# Altium schematic sheet zulu_a7_2.SchDoc
size 270 x 341 mm; Author: Christian Tambe; VERSION#: 1.0; Origin: Eagle; OriginPath: C:\Users\tambe\Documents\Electronics\Zulu_A7\Zulu_Altrium\zulu_a7.sch; OriginSheet: 3; OriginDescription: General IO
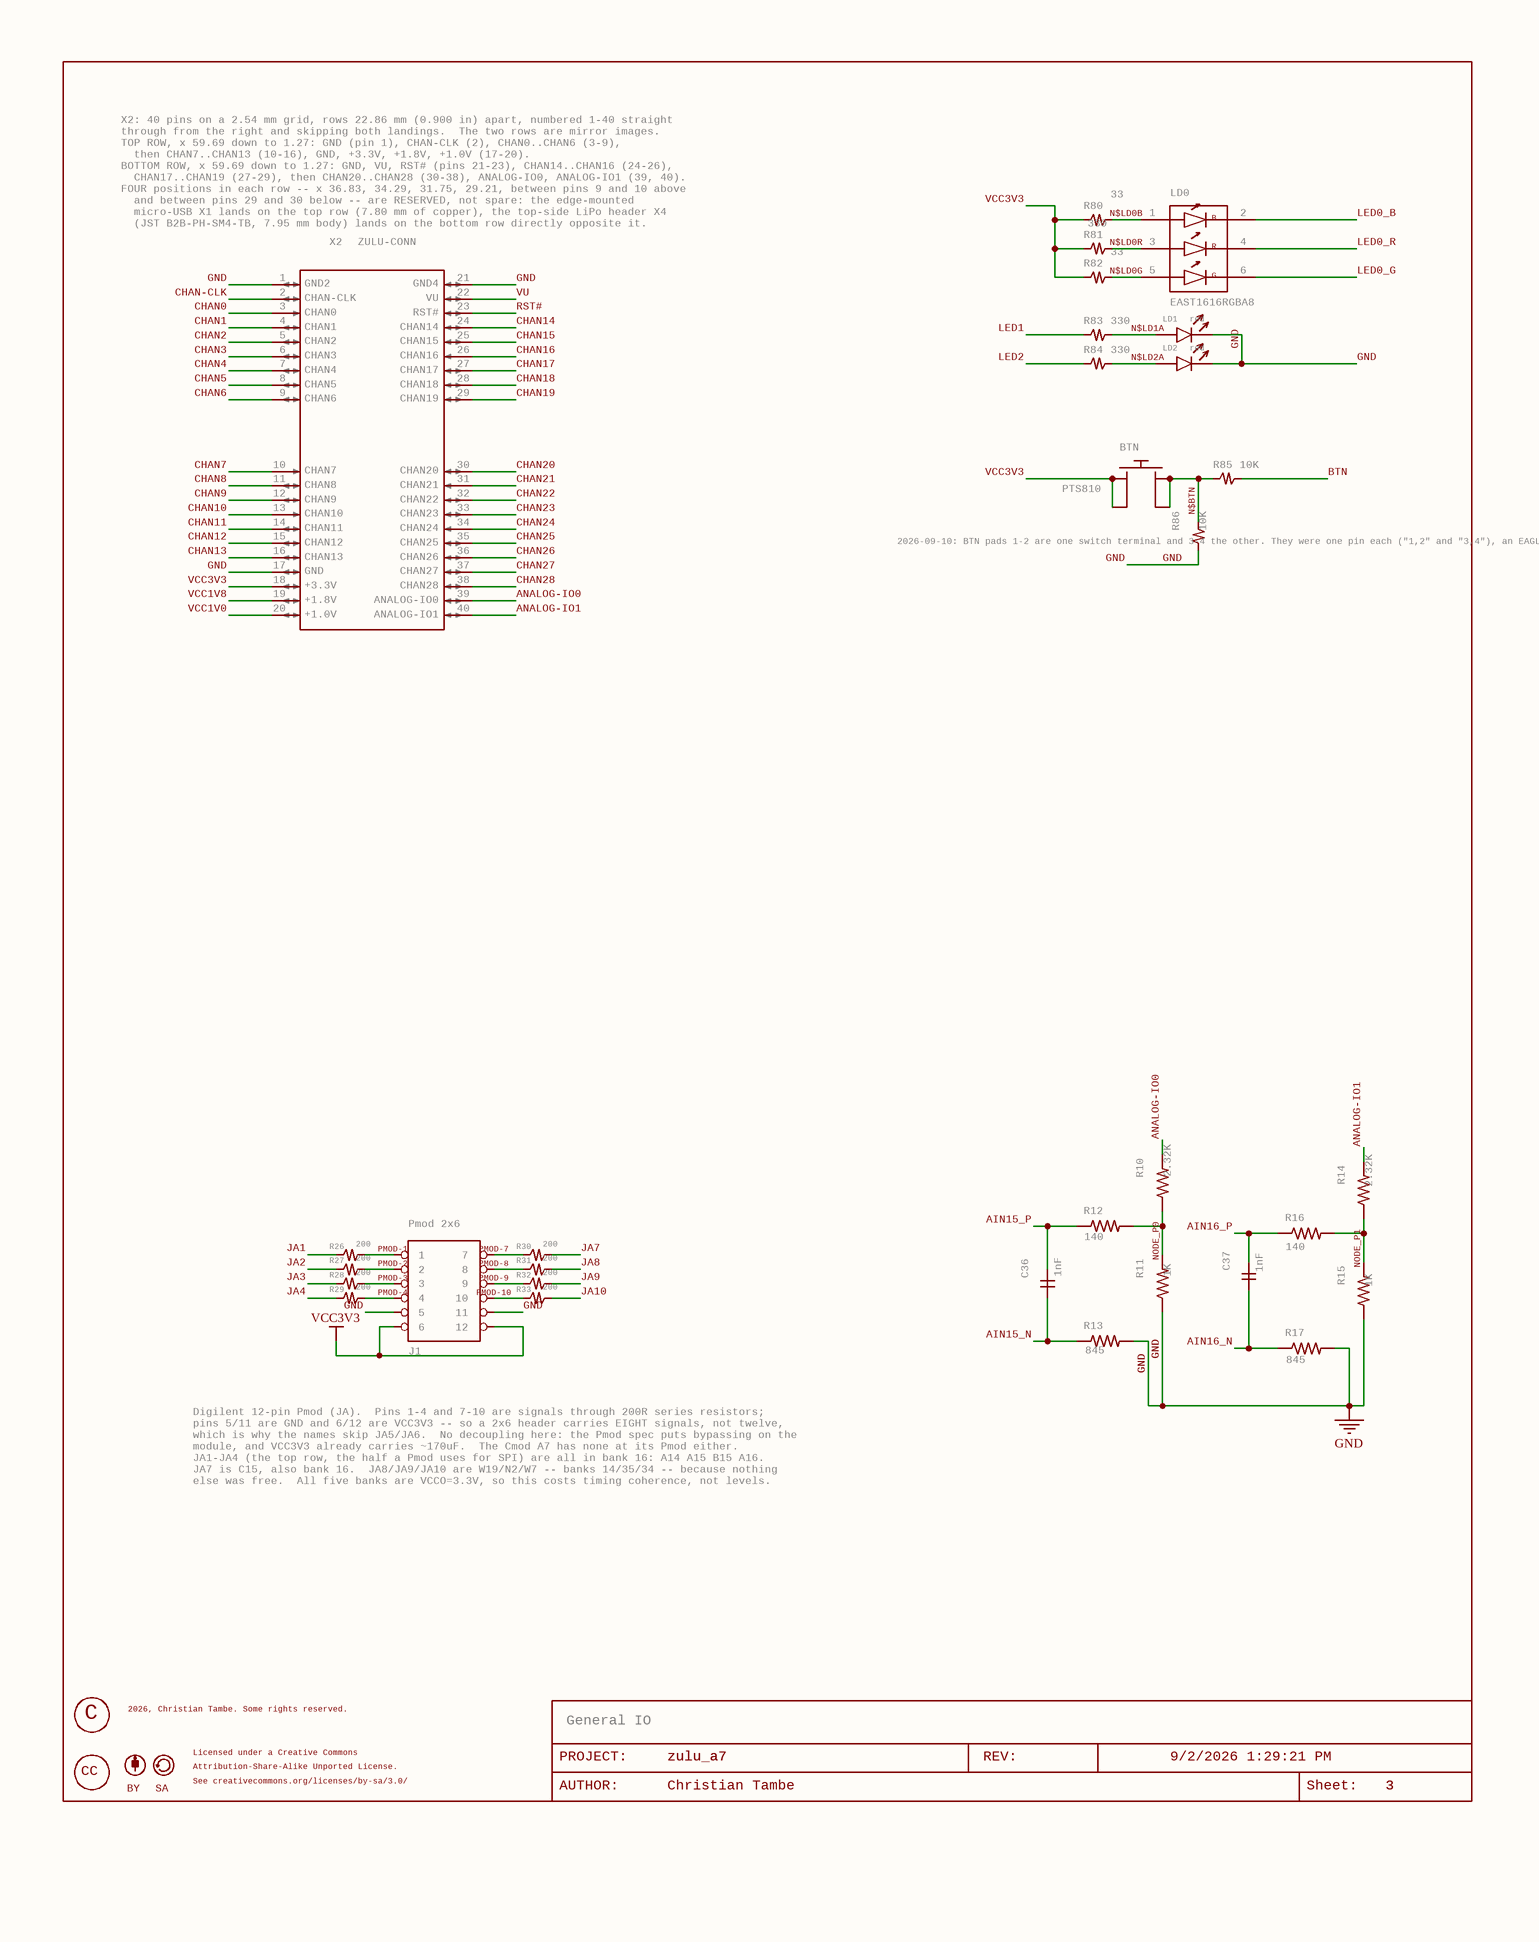
[diagram p0: zulu_a7_2.SchDoc]

## Parts
BTN  PTS810  [PTS810]
C36  1nF  [C0402]
C37  1nF  [C0402]
FRAME3  LAST_DATE_TIME: 9/2/2026 1:29:21 PM  Sheet: Sheet:  SHEET: 3  REV: REV:  PROJECT: PROJECT:  DRAWING_NAME: zulu_a7  AUTHOR: Christian Tambe  (hidden comment: DOCFIELD)  (graphical)
J1  Pmod 2x6  [2X06]
LD0  EAST1616RGBA8  [EVERLIGHT-19-337]
LD1  red  [LED0603]
LD2  red  [LED0603]
R10  2.32K  [R0201]
R11  1K  [R0201]
R12  140  [R0201]
R13  845  [R0201]
R14  2.32K  [R0201]
R15  1K  [R0201]
R16  140  [R0201]
R17  845  [R0201]
R26  200  [R0201]
R27  200  [R0201]
R28  200  [R0201]
R29  200  [R0201]
R30  200  [R0201]
R31  200  [R0201]
R32  200  [R0201]
R33  200  [R0201]
R80  33  [R0402]
R81  330  [R0402]
R82  33  [R0402]
R83  330  [R0402]
R84  330  [R0402]
R85  10K  [R0402]
R86  10K  [R0402]
U$2  CC_CC  [CC_CC]  (value not drawn)
U$3  CC_BY  [CC_BY]  (value not drawn)
U$4  CC_SA  [CC_SA]  (value not drawn)
U$5  CC_COPYRIGHT  [CC_COPYRIGHT]  (value not drawn)
X2  GATE: CHAN-CLK  [ZULU-DIP37]  (hidden comment: ZULU-CONN)  (parts A,B,C,D,E,F,G,H,I,J,K,L,M,N,O,P,Q,R,S,T,U,V,W,X,Y,Z,27,28,29,30,31,32,33,34,35,36,37,38,39,40,41 of 41)

## Nets
GND: J1.5 J1.11 LD1.K LD2.K R11.1 R13.2 R15.1 R17.2 R86.1 X2.1 X2.17 X2.21
VCC3V3: BTN.1 BTN.2 J1.6 J1.12 R80.1 R81.1 R82.1 X2.18
AIN15_N: C36.1 R13.1
AIN15_P: C36.2 R12.1
AIN16_N: C37.1 R17.1
AIN16_P: C37.2 R16.1
ANALOG-IO0: R10.2 X2.39
ANALOG-IO1: R14.2 X2.40
BTN: R85.2
CHAN0: X2.3
CHAN1: X2.4
CHAN2: X2.5
CHAN3: X2.6
CHAN4: X2.7
CHAN5: X2.8
CHAN6: X2.9
CHAN7: X2.10
CHAN8: X2.11
CHAN9: X2.12
CHAN10: X2.13
CHAN11: X2.14
CHAN12: X2.15
CHAN13: X2.16
CHAN14: X2.24
CHAN15: X2.25
CHAN16: X2.26
CHAN17: X2.27
CHAN18: X2.28
CHAN19: X2.29
CHAN20: X2.30
CHAN21: X2.31
CHAN22: X2.32
CHAN23: X2.33
CHAN24: X2.34
CHAN25: X2.35
CHAN26: X2.36
CHAN27: X2.37
CHAN28: X2.38
CHAN-CLK: X2.2
JA1: R26.1
JA2: R27.1
JA3: R28.1
JA4: R29.1
JA7: R30.2
JA8: R31.2
JA9: R32.2
JA10: R33.2
LED0_B: LD0.2
LED0_G: LD0.6
LED0_R: LD0.4
LED1: R83.1
LED2: R84.1
N$BTN: BTN.3 BTN.4 R85.1 R86.2
N$LD0B: LD0.1 R80.2
N$LD0G: LD0.5 R82.2
N$LD0R: LD0.3 R81.2
N$LD1A: LD1.A R83.2
N$LD2A: LD2.A R84.2
NODE_P0: R10.1 R11.2 R12.2
NODE_P1: R14.1 R15.2 R16.2
PMOD-1: J1.1 R26.2
PMOD-2: J1.2 R27.2
PMOD-3: J1.3 R28.2
PMOD-4: J1.4 R29.2
PMOD-7: J1.7 R30.1
PMOD-8: J1.8 R31.1
PMOD-9: J1.9 R32.1
PMOD-10: J1.10 R33.1
RST#: X2.23
VCC1V0: X2.20
VCC1V8: X2.19
VU: X2.22

## Notes on the sheet
- (near X2) X2: 40 pins on a 2.54 mm grid, rows 22.86 mm (0.900 in) apart, numbered 1-40 straight
  through from the right and skipping both landings.  The two rows are mirror images.
  TOP ROW, x 59.69 down to 1.27: GND (pin 1), CHAN-CLK (2), CHAN0..CHAN6 (3-9),
  then CHAN7..CHAN13 (10-16), GND, +3.3V, +1.8V, +1.0V (17-20).
  BOTTOM ROW, x 59.69 down to 1.27: GND, VU, RST# (pins 21-23), CHAN14..CHAN16 (24-26),
  CHAN17..CHAN19 (27-29), then CHAN20..CHAN28 (30-38), ANALOG-IO0, ANALOG-IO1 (39, 40).
  FOUR positions in each row -- x 36.83, 34.29, 31.75, 29.21, between pins 9 and 10 above
  and between pins 29 and 30 below -- are RESERVED, not spare: the edge-mounted
  micro-USB X1 lands on the top row (7.80 mm of copper), the top-side LiPo header X4
  (JST B2B-PH-SM4-TB, 7.95 mm body) lands on the bottom row directly opposite it.
  Each landing is 12.70 mm between the neighbouring pin centres, 11.176 mm clear.
  THREE grounds: pins 1, 17, 21.  Pin 18 is the only +3.3V pin.  Pin 22 VU SOURCES the
  4.4 V rail (bq24232 OUT) -- the +5V-INPUT pin and its D2/D3 went on 2026-09-09,
  so external power is the LiPo on X4.  THE PCB FOOTPRINT MUST BE REDRAWN: 40 pads named 1-40.
- (near R86) 2026-09-10: BTN pads 1-2 are one switch terminal and 3-4 the other. They were one pin each ("1,2" and "3,4"), an EAGLE multi-pad import artefact that matches no Altium footprint pad; now four pins, each pad on its partner's net.
- Digilent 12-pin Pmod (JA).  Pins 1-4 and 7-10 are signals through 200R series resistors;
  pins 5/11 are GND and 6/12 are VCC3V3 -- so a 2x6 header carries EIGHT signals, not twelve,
  which is why the names skip JA5/JA6.  No decoupling here: the Pmod spec puts bypassing on the
  module, and VCC3V3 already carries ~170uF.  The Cmod A7 has none at its Pmod either.
  JA1-JA4 (the top row, the half a Pmod uses for SPI) are all in bank 16: A14 A15 B15 A16.
  JA7 is C15, also bank 16.  JA8/JA9/JA10 are W19/N2/W7 -- banks 14/35/34 -- because nothing
  else was free.  All five banks are VCCO=3.3V, so this costs timing coherence, not levels.
- 2026, Christian Tambe. Some rights reserved.
- (near FRAME3) General IO
- (near U$4) Licensed under a Creative Commons
- (near U$4) Attribution-Share-Alike Unported License.
- (near U$4) See creativecommons.org/licenses/by-sa/3.0/
- (near FRAME3) AUTHOR:

## Library data of the parts
BTN = SWITCH_TACT: Tactile switch, momentary, normally open. Package PTA-142 is assigned and drawn from the datasheet land; the note that said otherwise was left behind when it was.; GateName_1: G$1; MANF#: PTS810SJM250SMTR LFS; MANF: Littelfuse (C&K); NOTE: PTS810SJM250SMTR LFS, Littelfuse (C&K) PTS810 series, Datasheet/Littelfuse-CK-Tactile-PTS810-Series-Datasheet.pdf rev 02/02/26. Recommended PCB layout (p1): four pads (5.2 - 3.1)/2 = 1.05 mm wide by (2.8 - 1.5)/2 = 0.65 mm high, centred at +-2.075 mm and +-1.075 mm; body 4.2 x 3.2 mm, J-leads to 4.6 mm, height 2.5 mm. The datasheet schematic joins 1 with 2 and 3 with 4, so pins 1,2 (VCC3V3) and 3,4 (BTN) are unchanged. Footprint PTS810 to be drawn at the PCB stage; the PTA-142 pattern (1.6 mm pads at +-3.75 / +-1.4 mm) does not fit. Other force grades on the same pads: K 2.6 N, G 4.0 N, S 6.0 N. Digi-Key 106,352 in stock at $0.58, 16-week lead (2026-09-08); LCSC C116501 dry, the K grade C221896 stocked.; SPEC: tactile switch SPST-NO momentary, SMT J-lead, 4.2 x 3.2 x 2.5 mm, 1.6 N (160 gf), 0.15 mm travel, 150000 cycles, 16 VDC 50 mA, -40..85 C; terminals 1-2 and 3-4 internally common (PTS810 sheet p1); replaced the unsourceable PTA-142 on 2026-09-08; SymbolName_1: SWITCH_TACT; LibraryName: ctambe; DeviceSetName: SWITCH_TACT
C36 C37 = C-GENERICC0402: CAPACITOR, generic non-polarized, horizontal pins; GateName_1: G$1; SymbolName_1: C-GENERIC-H; MANF: Murata; MANF#: GRM155R71H102KA01D; SPEC: X7R 50V +-10%, 0.50 mm max; DeviceName: C0402; LibraryName: rcl; DeviceSetName: C-GENERIC
FRAME3 = DOCFIELD: DOCUMENT FIELD; GateName_1: G$1; SymbolName_1: DOCFIELD; LibraryName: ctambe; DeviceSetName: DOCFIELD
J1 = PINHD-2X6: PIN HEADER 2x6 (Pmod)   Digilent peripheral-module connector. Pins 1-4 and 7-10 are signals, 5 and 11 are GND, 6 and 12 are VCC -- eight signals, not twelve.; GateName_1: G$1; SymbolName_1: PINH2X6; MANF: Sullins; MANF#: PPTC062LFBN-RC; NOTE: A SOCKET, NOT PINS, AND THE LIBRARY NAME DISAGREES WITH THAT. The package is called PIN HEADER 2x6 and the deviceset PINHD-2X6, which is inherited naming, but on a Digilent Pmod the HOST carries the female socket and the peripheral module carries the male pins that plug into it. Cmod A7 is the same. Order male pins off that library name and no Pmod will mate. The footprint is 12 plated holes on 2.54 either way, so a male header such as Sullins PRPC006DAAN-RC drops into the same land if you would rather have pins and a cable. Height 8.5 mm is not a problem: J1 is on the FRONT, and it is the back that faces a breadboard a couple of millimetres away.; SPEC: 2x6 female header, 2.54 mm pitch, through-hole, 12 way -- Pmod host socket; LibraryName: ctambe; DeviceSetName: PINHD-2X6
LD0 = LED_RGB: RGB LED, three independent diodes, 6 pads: anodes 1/3/5 (B/R/G), cathodes 2/4/6 (B/R/G). Everlight 19-337 package.; GateName_1: G$1; NOTE: Everlight EAST1616RGBA8 = 19-337/R6GHBHW-A01/2T (DSE-0009126 Rev.3, 22-Dec-2016); water-clear twin EAST1616RGBA4 = 19-337/R6GHBHC-A01/2T. Same body, lens and recommended pads as the Victory VS NRD8 it replaces (0.55 x 0.4 outer pads at +-0.725 mm, 0.7 x 0.5 middle, 1.9 / 2.2 mm spans) and the same arrangement: cathodes in the left column under the cathode mark, blue / red / green top to bottom, anodes on the right. Only the numbering differs (Everlight anodes 1/3/5 on the right, cathodes 2/4/6 on the left), so on 2026-09-08 the pins were renumbered 1/2/3 -> 2/4/6 and 4/5/6 -> 1/3/5 with the nets unchanged: LED0_B/R/G on the cathodes to the FPGA, N$LD0B/R/G on the anodes through R80/R81/R82. Footprint EVERLIGHT-19-337 = the VS-NRD8 pattern with Everlight pad numbers. Digi-Key 15,840 in stock at $0.43 on 2026-09-08.; SPEC: RGB LED, three independent diodes, 1.6 x 1.6 x 0.35 mm, diffused lens, 624 / 525 / 468 nm, VF typ 2.05 / 3.2 / 3.2 V (max 2.4 / 3.7 / 3.7), IF 25 mA max per colour; anodes 1 B, 3 R, 5 G, cathodes 2 B, 4 R, 6 G (19-337 sheet p8); replaced the distributor-less Victory VS NRD8 on 2026-09-08; SymbolName_1: LED_RGB; LibraryName: ctambe; DeviceSetName: LED_RGB; B: B; R: R; G: G; MANF: Everlight; MANF#: EAST1616RGBA8
LD1 = LED: GateName_1: G$1; MANF: Lite-On; MANF#: LTST-C191KRKT; NOTE: User status LED, driven straight off an FPGA pin through R83 at 330R: (3.3 - Vf)/330 is 3.9 mA green, 4.2 red, 3.6 yellow, and 1.2 mA blue or white. Any of the first three is comfortable and well inside an LVCMOS33 pin's 12 mA. RED IS A PREFERENCE, NOT A CONSTRAINT -- the circuit takes green just as happily. It is red so that the two user LEDs read differently from LD5, which is green and means power good; on a board being brought up that is worth being able to tell apart at a glance. Same LTST-C191 family and the same 0603 land as LD5, so it is one line in the catalogue, not two. Confirm the suffix before ordering.; SPEC: red indicator, 0603, Vf 2.1V max at 4mA; SymbolName_1: LED; LibraryName: ctambe; DeviceSetName: LED
LD2 = LED: GateName_1: G$1; MANF: Lite-On; MANF#: LTST-C191KRKT; NOTE: User status LED, driven straight off an FPGA pin through R84 at 330R: (3.3 - Vf)/330 is 3.9 mA green, 4.2 red, 3.6 yellow, and 1.2 mA blue or white. Any of the first three is comfortable and well inside an LVCMOS33 pin's 12 mA. RED IS A PREFERENCE, NOT A CONSTRAINT -- the circuit takes green just as happily. It is red so that the two user LEDs read differently from LD5, which is green and means power good; on a board being brought up that is worth being able to tell apart at a glance. Same LTST-C191 family and the same 0603 land as LD5, so it is one line in the catalogue, not two. Confirm the suffix before ordering.; SPEC: red indicator, 0603, Vf 2.1V max at 4mA; SymbolName_1: LED; LibraryName: ctambe; DeviceSetName: LED
R10 R14 = R-US_R0201: RESISTOR, American symbol; GateName_1: G$1; SymbolName_1: R-US; DeviceSetName: R-US_; MANF: Yageo; MANF#: RC0201FR-072K32L; SPEC: thick film +-1%, 1/20W, 0201; DeviceName: R0201; LibraryName: rcl
R11 R15 = R-US_R0201: RESISTOR, American symbol; GateName_1: G$1; SymbolName_1: R-US; DeviceSetName: R-US_; MANF: Yageo; MANF#: RC0201FR-071KL; SPEC: thick film +-1%, 1/20W, 0201; DeviceName: R0201; LibraryName: rcl
R12 R16 = R-US_R0201: RESISTOR, American symbol; GateName_1: G$1; SymbolName_1: R-US; DeviceSetName: R-US_; MANF: Yageo; MANF#: RC0201FR-07140RL; SPEC: thick film +-1%, 1/20W, 0201; DeviceName: R0201; LibraryName: rcl
R13 R17 = R-US_R0201: RESISTOR, American symbol; GateName_1: G$1; SymbolName_1: R-US; DeviceSetName: R-US_; MANF: Yageo; MANF#: RC0201FR-07845RL; SPEC: thick film +-1%, 1/20W, 0201; DeviceName: R0201; LibraryName: rcl
R26-R33 = R-US_SMALLR0201: RESISTOR, American symbol, small 2-zigzag variant (sheet 2 only); GateName_1: G$1; MANF: Yageo; MANF#: RC0201FR-07200RL; SPEC: thick film +-1%, 1/20W, 0201; SymbolName_1: R-US_SMALL; DeviceName: R0201; LibraryName: rcl; DeviceSetName: R-US_SMALL
R80 R82 = R-US_SMALLR0402: RESISTOR, American symbol, small 2-zigzag variant (sheet 2 only); GateName_1: G$1; MANF: Yageo; MANF#: RC0402FR-0733RL; NOTE: RGB LED balance. The green and blue dice are 3.3 V-class parts on a 3.3 V rail, so the resistor never dominates their current -- that is structural and no resistor value fixes it. What the values CAN do is stop red swamping the other two. As built, and as Cmod A7 ships the same LED, 182/182/100 gave red 6.9 mA against green 1.9 and blue 1.5: red about four times either. At 330/33/33 it is red 3.8, green 2.9, blue 2.9. Worst case improves too, not just nominal -- green with a part 0.15 V high in Vf goes from 1.4 mA to 1.8. Lower resistors do make the current MORE sensitive in percentage terms, 77 percent of nominal retained at 100R against 61 at 33R, but the absolute floor is what you see and it rises. Currents read off the datasheet's own Vf/If curve at the working point, not off the 20 mA table.; SPEC: thick film +-1%, 1/16W, 0402; SymbolName_1: R-US_SMALL; DeviceName: R0402; LibraryName: rcl; DeviceSetName: R-US_SMALL
R81 = R-US_SMALLR0402: RESISTOR, American symbol, small 2-zigzag variant (sheet 2 only); GateName_1: G$1; MANF: Yageo; MANF#: RC0402FR-07330RL; NOTE: RGB LED balance. The green and blue dice are 3.3 V-class parts on a 3.3 V rail, so the resistor never dominates their current -- that is structural and no resistor value fixes it. What the values CAN do is stop red swamping the other two. As built, and as Cmod A7 ships the same LED, 182/182/100 gave red 6.9 mA against green 1.9 and blue 1.5: red about four times either. At 330/33/33 it is red 3.8, green 2.9, blue 2.9. Worst case improves too, not just nominal -- green with a part 0.15 V high in Vf goes from 1.4 mA to 1.8. Lower resistors do make the current MORE sensitive in percentage terms, 77 percent of nominal retained at 100R against 61 at 33R, but the absolute floor is what you see and it rises. Currents read off the datasheet's own Vf/If curve at the working point, not off the 20 mA table.; SPEC: thick film +-1%, 1/16W, 0402; SymbolName_1: R-US_SMALL; DeviceName: R0402; LibraryName: rcl; DeviceSetName: R-US_SMALL
R83 R84 = R-US_SMALLR0402: RESISTOR, American symbol, small 2-zigzag variant (sheet 2 only); GateName_1: G$1; MANF: Yageo; MANF#: RC0402FR-07330RL; SPEC: thick film +-1%, 1/16W, 0402; SymbolName_1: R-US_SMALL; DeviceName: R0402; LibraryName: rcl; DeviceSetName: R-US_SMALL
R85 R86 = R-US_SMALLR0402: RESISTOR, American symbol, small 2-zigzag variant (sheet 2 only); GateName_1: G$1; MANF: Yageo; MANF#: RC0402FR-0710KL; SPEC: thick film +-1%, 1/16W, 0402; SymbolName_1: R-US_SMALL; DeviceName: R0402; LibraryName: rcl; DeviceSetName: R-US_SMALL
U$2 = CC_CC: GateName_1: G$1; SymbolName_1: CC_CC; LibraryName: ctambe; DeviceSetName: CC_CC; CC: CC
U$3 = CC_BY: GateName_1: G$1; SymbolName_1: CC_BY; LibraryName: ctambe; DeviceSetName: CC_BY; BY: BY
U$4 = CC_SA: GateName_1: G$1; SymbolName_1: CC_SA; LibraryName: ctambe; DeviceSetName: CC_SA; SA: SA
U$5 = CC_COPYRIGHT: GateName_1: G$1; SymbolName_1: CC_COPYRIGHT; LibraryName: ctambe; DeviceSetName: CC_COPYRIGHT; C: C
X2 = ZULU-CONN: Zulu A7 Board Connector; SymbolName_1: PIN_GATE_IO; GateName_2: CHAN0; SymbolName_2: PIN_GATE_IN; GateName_3: CHAN1; GateName_4: CHAN2; GateName_5: CHAN3; GateName_6: CHAN4; GateName_7: CHAN5; GateName_8: CHAN6; GateName_9: CHAN7; GateName_10: CHAN8; GateName_11: CHAN9; GateName_12: CHAN10; GateName_13: CHAN11; GateName_14: +1.8V; GateName_15: +3.3V; GateName_16: GND; GateName_17: +1.0V; GateName_18: RST#; GateName_19: CHAN14; GateName_20: CHAN15; GateName_21: CHAN16; GateName_22: CHAN17; GateName_23: CHAN18; GateName_24: CHAN19; GateName_25: CHAN20; GateName_26: CHAN21; GateName_27: CHAN22; GateName_28: CHAN23; GateName_29: CHAN24; GateName_30: CHAN25; GateName_31: CHAN26; GateName_32: CHAN27; GateName_33: ANALOG-IO0; GateName_34: ANALOG-IO1; GateName_35: CHAN28; GateName_36: G$1; SymbolName_36: PV_GATE; GateName_37: GND2; GateName_38: CHAN12; GateName_39: CHAN13; GateName_40: GND4; GateName_41: VU; MANF: Sullins; MANF#: 2x PRPC009SAAN-RC + 2x PRPC011SAAN-RC; SPEC: four 0.1 in male breakaway header strips, 0.64 mm square gold-flash pins, 2.54 mm pitch, through-hole, mounted from the underside, two part numbers and two of each per board: PRPC009SAAN-RC 1x9 twice (pins 1-9 and 21-29) and PRPC011SAAN-RC 1x11 twice (pins 10-20 and 30-40); the two rows are cut identically since the LiPo landing was moved opposite the micro-USB on 2026-09-09; NOTE: Pin field ZULU-DIP37: 40 pins of 1.016 mm on 2.54 mm pitch, two rows 22.86 mm (0.900 in) apart, numbered 1-40 straight through and skipping both landings. The rows are mirror images: top row pins 1-9 (x 59.69..39.37) = GND, CHAN-CLK, CHAN0..CHAN6, FOUR positions for the micro-USB X1 (36.83..29.21), pins 10-20 (26.67..1.27) = CHAN7..CHAN13, GND, +3.3V, +1.8V, +1.0V (channel order since 2026-09-09, power pins re-ordered 2026-10-07); bottom row pins 21-29 (59.69..39.37), FOUR positions for the LiPo header X4 at the SAME four x values (36.83..29.21), pins 30-40 (26.67..1.27), so X4 sits on the top side directly opposite the edge-mounted USB receptacle. Each landing is 12.70 mm between the neighbouring pin centres, 11.176 mm clear: the JST B2B-PH-SM4-TB body is 7.95 mm, so 1.61 mm each side. Reworked 2026-09-09 from the old 44-position pattern: +5V-INPUT with D2/D3, GND5, GND3 and +3.3V2 removed, CHAN12/CHAN13 moved to pins 2/3, the bottom row closed up, the field renumbered and the landing moved. Three grounds (1, 17, 21); 3.3 V for the header is pin 18 alone; pin 22 VU sources the 4.4 V rail. THE PCB FOOTPRINT MUST BE REDRAWN with 40 pads named 1-40 in these positions -- the imported ZULU-DIP37 still names 44. Sullins PRPC strips fit the holes (0.64 mm square pins, Sullins recommends 1.02 mm). Digi-Key 2026-09-08: PRPC009SAAN-RC 1,201 at $0.18, PRPC011SAAN-RC 428 at $0.22, two of each per board (the 1x11 stock covers about 200 boards). Alternate: any 2.54 mm 1x40 breakaway strip (LCSC Boomele C2337, 81,690) cut to 9 + 11 twice.; GateName_1: CHAN-CLK; SymbolName_3: PIN_GATE_IO; SymbolName_4: PIN_GATE_IO; SymbolName_5: PIN_GATE_IO; SymbolName_6: PIN_GATE_IO; SymbolName_7: PIN_GATE_IO; SymbolName_8: PIN_GATE_IO; SymbolName_9: PIN_GATE_IN; SymbolName_10: PIN_GATE_IO; SymbolName_11: PIN_GATE_IO; SymbolName_12: PIN_GATE_IN; SymbolName_13: PIN_GATE_IO; SymbolName_14: PIN_GATE_IO; SymbolName_15: PIN_GATE_IO; SymbolName_16: PIN_GATE_IO; SymbolName_17: PIN_GATE_IO; SymbolName_18: PIN_GATE_IO; SymbolName_19: PIN_GATE_IO; SymbolName_20: PIN_GATE_IO; SymbolName_21: PIN_GATE_IN; SymbolName_22: PIN_GATE_IO; SymbolName_23: PIN_GATE_IO; SymbolName_24: PIN_GATE_IO; SymbolName_25: PIN_GATE_IO; SymbolName_26: PIN_GATE_IN; SymbolName_27: PIN_GATE_IO; SymbolName_28: PIN_GATE_IO; SymbolName_29: PIN_GATE_IN; SymbolName_30: PIN_GATE_IO; SymbolName_31: PIN_GATE_IO; SymbolName_32: PIN_GATE_IO; SymbolName_33: PIN_GATE_IO; SymbolName_34: PIN_GATE_IO; SymbolName_35: PIN_GATE_IO; SymbolName_37: PIN_GATE_IO; SymbolName_38: PIN_GATE_IO; SymbolName_39: PIN_GATE_IO; SymbolName_40: PIN_GATE_IO; SymbolName_41: PIN_GATE_IO; LibraryName: ctambe; DeviceSetName: ZULU-CONN